# Altium schematic sheet [7] Cell_balancing.SchDoc
size A4
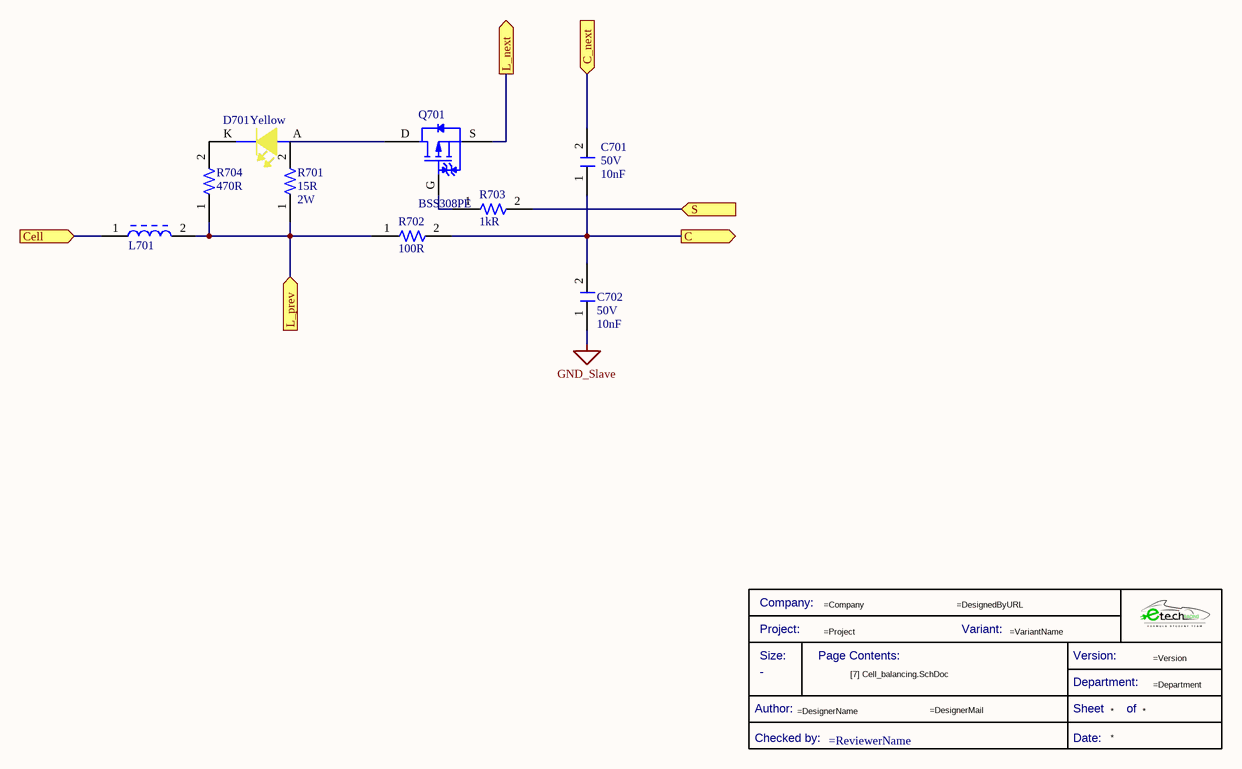
[diagram p0: [7] Cell_balancing.SchDoc]

## Parts
*?  Title Block_template  (value not drawn)  (graphical)
C701  Voltage Rating: 50V  Capacitance: 10nF  [C0805FNPC-R]  (hidden comment: 885012207092)
C702  Voltage Rating: 50V  Capacitance: 10nF  [C0805FNPC-R]  (hidden comment: 885012207092)
D701  Color: Yellow  [LED_0805_WE]  (hidden comment: 150080YS75000)
L701  782853561  [L_Ferrite_bead_0805]  (value not drawn)
Q701  BSS308PE  [TRT-PCH-2/30-BSS]
R701  value 15R  Max Power Dissipation: 2W  [R2512FTK]  (hidden comment: 352115RFT)
R702  Resistance: 100R  [R0805FTK]  (hidden comment: CR0805-FX-1000ELF)
R703  Resistance: 1kR  [R0805FTK]  (hidden comment: CR0805-JW-102ELF)
R704  Resistance: 470R  [R0805FTK]  (hidden comment: CR0805-FX-4700GLF)

## Ports
C (out), C_next (in), Cell (in), L_next (out), L_prev (in), S (in)

## Nets
GND_Slave: C702.1
C: C701.1 C702.2 R702.2 ; port C
C_next: C701.2 ; port C_next
Cell: L701.1 ; port Cell
L_next: Q701.S ; port L_next
L_prev: L701.2 R701.1 R702.1 R704.1 ; port L_prev
S: R703.2 ; port S
NetD701_A: D701.A Q701.D R701.2
NetD701_K: D701.K R704.2
NetQ701_G: Q701.G R703.1

## Notes on the sheet
- Title
- Size:
- Date:
- A4
- Number:
- Time:
- Revision:
- Sheet
- of
- File:
- (in symbol Title Block_template) Company:; Project:; Variant:; Size:; Page Contents:; Version:; Department:; Author:; Sheet; of; Checked by:; Date:

## Library data of the parts
*? = Title Block_template: Standard Title Block; Category: Title Block; Checked by:: =ReviewerName; Size: -
C701 C702 = C10n-50V-0805FNPC-X7R: Cap, 0.01ΜF, 50V, 10%, X7R, 0805; Manufacturer 1: Wurth Electronics; .Creator: DR; Supplier 1: RSComponents; Manufacturer Part Number 1: 885012207092; RoHS: Yes; Category: Ceramic Capacitors; Stock 1: 1; Pricing 1: 4000=0,03200, 12000=0,03100 (USD); Mount: Surface Mount; Case/Package: 0805; Case Code (Metric): 2012; Case Code (Imperial): 0805; Min Operating Temperature: -55°C; Max Operating Temperature: 125°C; Packaging: Cut Tape; Dielectric: X7R; Tolerance: 10%; Voltage Rating (DC): 50V; Length: 0.079inch; Width: 0.049inch; Thickness: 0.035inch; REACH SVHC: Unknown; RoHS Compliant: Yes; ComponentLink1URL: http://www.farnell.com/datasheets/1958497.pdf?src-supplier=Farnell; ComponentLink1Description: http://www.farnell.com/datasheets/1958497.pdf?src-supplier=Farnell; ComponentLink2URL: http://www.farnell.com/datasheets/1958497.pdf?src-supplier=Element14; ComponentLink2Description: http://www.farnell.com/datasheets/1958497.pdf?src-supplier=Element14; ComponentLink3URL: http://www.farnell.com/datasheets/1958497.pdf?src-supplier=Newark; ComponentLink3Description: http://www.farnell.com/datasheets/1958497.pdf?src-supplier=Newark; ComponentLink4URL: https://katalog.we-online.de/pbs/datasheet/885012207092.pdf?src-supplier=Digi-Key; ComponentLink4Description: https://katalog.we-online.de/pbs/datasheet/885012207092.pdf?src-supplier=Digi-Key; Supplier Part Number 1: 1813941
D701 = LEDYS-0805-120: 2 V Yellow LED 2012 (0805) SMD, Wurth Elektronik WL-SMCW 150080YS75000; Manufacturer 1: Wurth Electronics; Luminous Intensity: 120mcd; Forward Current: 30mA; Forward Voltage: 2V; Viewing Angle: 140°; Wavelength: 590nm; Lens Style: Clear,Rectangular; Test Current: 20mA; .Creator: DR; ComponentLink1Description: Datasheet; ComponentLink1URL: https://www.we-online.com/catalog/datasheet/150080YS75000.pdf; ComponentLink2Description: Where buy it; ComponentLink2URL: https://katalog.we-online.de/en/led/WL-SMCW/150080YS75000; Supplier 1: RSComponents; Manufacturer Part Number 1: 150080YS75000; RoHS: Yes; Category: LEDs; Stock 1: 2100; Pricing 1: 50=0,19300, 500=0,12900, 750=0,12300, 1500=0,11700, 3000=0,11100 (USD); Mount: Surface Mount; Case/Package: 0805; Case Code (Metric): 2012; Case Code (Imperial): 0805; Min Operating Temperature: -40°C; Max Operating Temperature: 85°C; Package Quantity: 4000; Packaging: Tape and Reel; Dominant Wavelength: 590nm; Length: 2mm; Width: 1.25mm; Height: 0.7mm; REACH SVHC: Unknown; RoHS Compliant: Yes; ComponentLink3URL: https://datasheet.ciiva.com/23843/150080ys75000-23843256.pdf?src-supplier=Newark; ComponentLink3Description: https://datasheet.ciiva.com/23843/150080ys75000-23843256.pdf?src-supplier=Newark; ComponentLink4URL: https://datasheet.ciiva.com/29279/759438-da-01-en-chipled-0805-w-kl-gelb-150080ys75000-29279034.pdf?src-supplier=Conrad; ComponentLink4Description: https://datasheet.ciiva.com/29279/759438-da-01-en-chipled-0805-w-kl-gelb-150080ys75000-29279034.pdf?src-supplier=Conrad; ComponentLink5URL: https://datasheet.ciiva.com/22656/1911353-22656971.pdf?src-supplier=Element14; ComponentLink5Description: https://datasheet.ciiva.com/22656/1911353-22656971.pdf?src-supplier=Element14; ComponentLink6URL: https://datasheet.ciiva.com/29563/150080ys75000-29563019.pdf?src-supplier=Digi-Key; ComponentLink6Description: https://datasheet.ciiva.com/29563/150080ys75000-29563019.pdf?src-supplier=Digi-Key; ComponentLink7URL: https://datasheet.ciiva.com/29563/150080ys75000-29563020.pdf?src-supplier=Digi-Key; ComponentLink7Description: https://datasheet.ciiva.com/29563/150080ys75000-29563020.pdf?src-supplier=Digi-Key; ComponentLink8URL: https://datasheet.ciiva.com/29563/150080ys75000-29563021.pdf?src-supplier=Digi-Key; ComponentLink8Description: https://datasheet.ciiva.com/29563/150080ys75000-29563021.pdf?src-supplier=Digi-Key; Supplier Part Number 1: 8154231
L701 = L_Ferrite_bead_782853561: Manufacturer: Murata; Manufacturer Part Number: BLM18EG331TN1D; Material: Ferrite,Steel; Impedance: 330R; DC Resistance (DCR): 210mR; Tolerance: 25%; Current Rating: 500mA; Number of Lines: 1; Test Frequency: 100MHz; .Creator: GP; Supplier 1: Digi-Key; RoHS: Yes; Category: Ferrite Beads and Chips; Stock 1: 20037; Pricing 1: 1=0,23000, 10=0,17500, 25=0,14520, 50=0,12520, 100=0,11260, 250=0,09508, 500=0,08508, 1000=0,07257 (USD); Case/Package: 0603; Number of Pins: 2; Core Material: Ferrite; Case Code (Metric): 1608; Case Code (Imperial): 0603; Min Operating Temperature: -55°C; Max Operating Temperature: 125°C; Packaging: Tape and Reel; Max DC Current: 500mA; Number of Circuits: 1; Package Quantity: 1; Max Current Rating: 500mA; Termination: SMD/SMT; Series: BLM18E; Resistance: 210mR; Length: 1.6mm; Width: 0.8mm; Height: 0.8mm; Depth: 0.8mm; REACH SVHC: No SVHC; Lead Free: Lead Free; RoHS Compliant: Yes; ComponentLink1URL: https://datasheet.ciiva.com/1467/5169-1467232.pdf?src-supplier=Element14; ComponentLink1Description: https://datasheet.ciiva.com/1467/5169-1467232.pdf?src-supplier=Element14; ComponentLink2URL: https://datasheet.ciiva.com/11795/0900766b811b5866-11795405.pdf?src-supplier=RSComponents; ComponentLink2Description: https://datasheet.ciiva.com/11795/0900766b811b5866-11795405.pdf?src-supplier=RSComponents; ComponentLink3URL: https://datasheet.ciiva.com/41449/001172267-da-01-en-drossel-0603-330r-1-6x0-8mm-4000st-41449581.pdf?src-supplier=Conrad; ComponentLink3Description: https://datasheet.ciiva.com/41449/001172267-da-01-en-drossel-0603-330r-1-6x0-8mm-4000st-41449581.pdf?src-supplier=Conrad; ComponentLink4URL: https://datasheet.ciiva.com/1467/5169-1467233.pdf?src-supplier=Element14; ComponentLink4Description: https://datasheet.ciiva.com/1467/5169-1467233.pdf?src-supplier=Element14; ComponentLink5URL: https://datasheet.ciiva.com/1561/5169-1561345.pdf?src-supplier=Newark; ComponentLink5Description: https://datasheet.ciiva.com/1561/5169-1561345.pdf?src-supplier=Newark; ComponentLink6URL: https://datasheet.ciiva.com/3082/l0110s0101blm18e-3082714.pdf?src-supplier=Avnet; ComponentLink6Description: https://datasheet.ciiva.com/3082/l0110s0101blm18e-3082714.pdf?src-supplier=Avnet; ComponentLink7URL: https://datasheet.ciiva.com/6211/l0110s0101blm18e-6211470.pdf?src-supplier=Digi-Key; ComponentLink7Description: https://datasheet.ciiva.com/6211/l0110s0101blm18e-6211470.pdf?src-supplier=Digi-Key; ComponentLink8URL: https://datasheet.ciiva.com/6211/l0110s0101blm18e-6211471.pdf?src-supplier=Digi-Key; ComponentLink8Description: https://datasheet.ciiva.com/6211/l0110s0101blm18e-6211471.pdf?src-supplier=Digi-Key; Supplier Part Number 1: 490-5913-1-ND
Q701 = TRT-PCH-2/30-BSS: Infineon’s highly innovative OptiMOS™ families include p-channel power MOSFETs, SOT-23-3, RoHS; Manufacturer Part Number: BSS308PEH6327; Continuous Drain Current (ID): 2A; Input Capacitance: 500pF; Drain to Source Voltage (Vdss): 30V; Max Power Dissipation: 500mW; Gate to Source Voltage (Vgs): 20V; Rds On Max: 80mR; Rise Time: 7.7ns; Turn-Off Delay Time: 15.3ns; Fall Time: 2.8ns; Turn-On Delay Time: 5.6ns; Threshold Voltage: -1.5V; .Creator: DO; Supplier 1: RSComponents; Manufacturer: Infineon; RoHS: Yes; Category: MOSFETs; Stock 1: 4000; Pricing 1: 50=0,50300, 100=0,26400, 250=0,25900, 500=0,25200, 1000=0,24700 (USD); Mount: Surface Mount; Case/Package: TO-236-3; Number of Pins: 3; Min Operating Temperature: -55°C; Max Operating Temperature: 150°C; Packaging: Tape and Reel; Package Quantity: 1; Series: OptiMOS™; REACH SVHC: No SVHC; ComponentLink1URL: https://datasheet.ciiva.com/6379/infineon-bss308pe-ds-v02-03-en-6379920.pdf?src-supplier=Digi-Key; ComponentLink1Description: datasheet; ComponentLink2URL: https://datasheet.ciiva.com/11171/infineon-bss308pe-ds-v02-03-en-11171385.pdf?src-supplier=Avnet; ComponentLink2Description: https://datasheet.ciiva.com/11171/infineon-bss308pe-ds-v02-03-en-11171385.pdf?src-supplier=Avnet; Supplier Part Number 1: 8235500
R701 = R15-2512FTK: Res Thick Film 2512 15 Ohm 1% 2W ±100ppm/C Pad SMD T/R; Manufacturer 1: TE Connectivity; Temperature Coefficient: 100ppm/°C; Voltage Rating: 250V; Number of Resistors: 1; .Creator: DR; ComponentLink1Description: Datasheet; ComponentLink1URL: https://docs.rs-online.com/8bc1/0900766b81096b90.pdf; ComponentLink2Description: Where buy it; ComponentLink2URL: https://es.rs-online.com/web/p/resistencias-de-montaje-en-superficie/7551110; Supplier 1: RSComponents; Manufacturer Part Number 1: 352115RFT; RoHS: Yes; Category: Chip SMD Resistors; Stock 1: 1; Pricing 1: 10=0,64300, 250=0,62200, 1000=0,60000, 2000=0,55400, 2500=0,52100 (USD); Mount: Surface Mount; Case/Package: 2512; Case Code (Metric): 6432; Case Code (Imperial): 2512; Min Operating Temperature: -55°C; Max Operating Temperature: 155°C; Packaging: Tape and Reel; Tolerance: 1%; Resistor Type: Thick Film,Power resistor; Number of Terminations: 2; Termination: Solder; Voltage Rating (DC): 250V; Features: Automotive AEC-Q200; Series: 3521, CGS; Technology: THICK FILM; Resistance Tolerance: 1%; Length: 6.3mm; Height: 0.55mm; Depth: 3.2mm; RoHS Compliant: Yes; REACH SVHC: No SVHC; ELV: Compliant; ComponentLink3URL: https://datasheet.ciiva.com/25610/0900766b81096b90-25610033.pdf?src-supplier=RSComponents; ComponentLink3Description: https://datasheet.ciiva.com/25610/0900766b81096b90-25610033.pdf?src-supplier=RSComponents; ComponentLink4URL: https://datasheet.ciiva.com/46391/1610601-46391493.pdf?src-supplier=Element14; ComponentLink4Description: https://datasheet.ciiva.com/46391/1610601-46391493.pdf?src-supplier=Element14; ComponentLink5URL: https://datasheet.ciiva.com/7657/1610601-7657542.pdf?src-supplier=Element14; ComponentLink5Description: https://datasheet.ciiva.com/7657/1610601-7657542.pdf?src-supplier=Element14; Supplier Part Number 1: 7551110P
R702 = R100-0805FTK: Res Thick Film 0805 100 Ohm 1% 1/8W ±100ppm/°C Molded SMD SMD Paper Tape on Plastic Reel; Manufacturer 1: Bourns; Power Rating: 125mW; Voltage Rating: 150V; .Creator: DR; Supplier 1: Arrow Electronics; Manufacturer Part Number 1: CR0805-FX-1000ELF; RoHS: Yes; Category: Chip SMD Resistors; Stock 1: 49802; Pricing 1: 1=0,05840, 10=0,03430, 25=0,01780, 100=0,00750, 250=0,00560, 500=0,00490, 3000=0,00470 (USD); Mount: Surface Mount; Case/Package: 0805; Number of Pins: 2; Contact Plating: Tin; Case Code (Imperial): 0805; Case Code (Metric): 2012; Min Operating Temperature: -55°C; Max Operating Temperature: 155°C; Tolerance: 1%; Resistor Type: Thick Film; Temperature Coefficient: 100ppm/°C; Packaging: Tape and Reel; Package Quantity: 1; Termination: SMD/SMT; Number of Terminations: 2; Max Power Dissipation: 125mW; Voltage Rating (DC): 150V; Features: Moisture Resistant; Series: CR0805; Resistance Tolerance: 1%; Construction: Rectangular; Technology: THICK FILM; Length: 2mm; Width: 1.25mm; Height: 0.5mm; Depth: 1.25mm; Thickness: 508um; Radiation Hardening: No; REACH SVHC: No SVHC; Military Standard: Not; RoHS Compliant: Yes; ComponentLink1URL: https://datasheet.ciiva.com/11809/0900766b80fcdb72-11809178.pdf?src-supplier=RSComponents; ComponentLink1Description: https://datasheet.ciiva.com/11809/0900766b80fcdb72-11809178.pdf?src-supplier=RSComponents; ComponentLink2URL: https://datasheet.ciiva.com/6547/chpreztr-6547413.pdf?src-supplier=Digi-Key; ComponentLink2Description: https://datasheet.ciiva.com/6547/chpreztr-6547413.pdf?src-supplier=Digi-Key; ComponentLink3URL: https://datasheet.ciiva.com/6547/chpreztr-6547414.pdf?src-supplier=Digi-Key; ComponentLink3Description: https://datasheet.ciiva.com/6547/chpreztr-6547414.pdf?src-supplier=Digi-Key; ComponentLink4URL: https://datasheet.ciiva.com/6547/chpreztr-6547415.pdf?src-supplier=Digi-Key; ComponentLink4Description: https://datasheet.ciiva.com/6547/chpreztr-6547415.pdf?src-supplier=Digi-Key; ComponentLink5URL: https://datasheet.ciiva.com/9120/chpreztr-9120744.pdf?src-supplier=Avnet; ComponentLink5Description: https://datasheet.ciiva.com/9120/chpreztr-9120744.pdf?src-supplier=Avnet; Supplier Part Number 1: CR0805-FX-1000ELF
R703 = R1k-0805FTK: Res Thick Film 0805 1K Ohm 5% 1/8W ±200ppm/°C Molded SMD SMD Paper Tape on Plastic Reel; Manufacturer 1: Bourns; Voltage Rating (DC): 150V; Power Rating: 125mW; .Creator: GP; Supplier 1: Arrow Electronics; Manufacturer Part Number 1: CR0805-JW-102ELF; RoHS: Yes; Category: Chip SMD Resistors; Stock 1: 27510; Pricing 1: 1=0,05930, 10=0,03510, 25=0,01790, 100=0,00800, 250=0,00790, 500=0,00590, 1000=0,00360, 3000=0,00350, 6000=0,00250 (USD); Mount: Surface Mount; Case/Package: 0805; Number of Pins: 2; Contact Plating: Tin; Case Code (Metric): 2012; Case Code (Imperial): 0805; Min Operating Temperature: -55°C; Max Operating Temperature: 155°C; Resistor Type: Thick Film; Tolerance: 5%; Temperature Coefficient: 200ppm/°C; Features: Moisture Resistant; Package Quantity: 1; Packaging: Tape and Reel; Voltage Rating: 150V; Number of Terminations: 2; Termination: SMD/SMT; Max Power Dissipation: 125mW; Length: 2mm; Width: 1.25mm; Height: 0.5mm; Thickness: 508um; Depth: 1.25mm; Radiation Hardening: No; Lead Free: Lead Free; REACH SVHC: No SVHC; Military Standard: Not; ComponentLink1URL: https://datasheet.ciiva.com/11821/0900766b80fcdb72-11821134.pdf?src-supplier=RSComponents; ComponentLink1Description: https://datasheet.ciiva.com/11821/0900766b80fcdb72-11821134.pdf?src-supplier=RSComponents; ComponentLink2URL: https://datasheet.ciiva.com/15225/getdatasheetpartid-78155-15225381.pdf?src-supplier=Verical; ComponentLink2Description: https://datasheet.ciiva.com/15225/getdatasheetpartid-78155-15225381.pdf?src-supplier=Verical; ComponentLink3URL: https://datasheet.ciiva.com/22693/1902866-22693253.pdf?src-supplier=Element14; ComponentLink3Description: https://datasheet.ciiva.com/22693/1902866-22693253.pdf?src-supplier=Element14; ComponentLink4URL: https://datasheet.ciiva.com/7986/1856384-7986184.pdf?src-supplier=Element14; ComponentLink4Description: https://datasheet.ciiva.com/7986/1856384-7986184.pdf?src-supplier=Element14; ComponentLink5URL: https://datasheet.ciiva.com/7985/1856384-7985867.pdf?src-supplier=Element14; ComponentLink5Description: https://datasheet.ciiva.com/7985/1856384-7985867.pdf?src-supplier=Element14; ComponentLink6URL: https://datasheet.ciiva.com/30242/159chpreztr-30242765.pdf?src-supplier=Onlinecomponents.com; ComponentLink6Description: https://datasheet.ciiva.com/30242/159chpreztr-30242765.pdf?src-supplier=Onlinecomponents.com; ComponentLink7URL: https://datasheet.ciiva.com/6547/chpreztr-6547359.pdf?src-supplier=Digi-Key; ComponentLink7Description: https://datasheet.ciiva.com/6547/chpreztr-6547359.pdf?src-supplier=Digi-Key; Supplier Part Number 1: CR0805-JW-102ELF
R704 = R470-0805FTK: Res Thick Film 0805 470 Ohm 1% 1/8W ±100ppm/°C Molded SMD SMD Paper Tape on Plastic Reel; Manufacturer 1: Bourns; Power Rating: 125mW; Voltage Rating: 150V; .Creator: DR; Supplier 1: Arrow Electronics; Manufacturer Part Number 1: CR0805-FX-4700GLF; RoHS: Yes; Category: Chip SMD Resistors; Stock 1: 12623; Pricing 1: 1=0,00990, 10=0,00980, 25=0,00950, 50=0,00940, 100=0,00930, 250=0,00920, 500=0,00910, 1000=0,00890, 3000=0,00870, 6000=0,00860 (USD); Mount: Surface Mount; Case/Package: 0805; Number of Pins: 2; Case Code (Imperial): 0805; Case Code (Metric): 2012; Contact Plating: Tin; Min Operating Temperature: -55°C; Max Operating Temperature: 155°C; Packaging: Tape and Reel; Tolerance: 1%; Resistor Type: Thick Film; Termination: SMD/SMT; Temperature Coefficient: 100ppm/°C; Voltage Rating (DC): 150V; Features: Moisture Resistant; Series: CR0805; Max Power Dissipation: 125mW; Number of Terminations: 2; Resistance Tolerance: 1%; Construction: Rectangular; Technology: THICK FILM; Length: 2mm; Height: 0.5mm; Depth: 1.25mm; Thickness: 508um; Radiation Hardening: No; REACH SVHC: No SVHC; Military Standard: Not; ComponentLink1URL: https://datasheet.ciiva.com/11808/0900766b80fcdb72-11808686.pdf?src-supplier=RSComponents; ComponentLink1Description: https://datasheet.ciiva.com/11808/0900766b80fcdb72-11808686.pdf?src-supplier=RSComponents; ComponentLink2URL: https://datasheet.ciiva.com/7985/1856384-7985880.pdf?src-supplier=Element14; ComponentLink2Description: https://datasheet.ciiva.com/7985/1856384-7985880.pdf?src-supplier=Element14; ComponentLink3URL: https://datasheet.ciiva.com/22693/1902866-22693247.pdf?src-supplier=Element14; ComponentLink3Description: https://datasheet.ciiva.com/22693/1902866-22693247.pdf?src-supplier=Element14; ComponentLink4URL: https://datasheet.ciiva.com/5541/chpreztr-5541930.pdf?src-supplier=Mouser; ComponentLink4Description: https://datasheet.ciiva.com/5541/chpreztr-5541930.pdf?src-supplier=Mouser; Supplier Part Number 1: CR0805-FX-4700GLF